# Altium schematic sheet USB.SchDoc
size A4
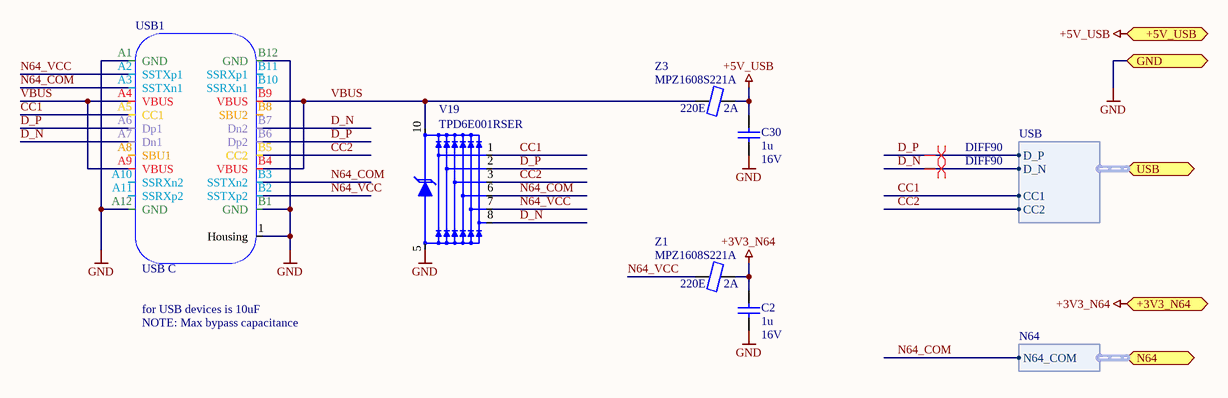
[diagram p0: USB.SchDoc]

## Parts
C2  value 1u  Value2: 16V  [SMD_CAP_0603]  (hidden comment: C_SMD_CER_1U_16V_10%_X7R_0603)
C30  value 1u  Value2: 16V  [SMD_CAP_0603]  (hidden comment: C_SMD_CER_1U_16V_10%_X7R_0603)
USB1  Type: USB C  [SMD_CON_USB_TYPEC_VERTICAL_10132328-10011LF]  (hidden comment: *)
V19  Type: TPD6E001RSER  [SMD_UQFN-10]  (hidden comment: V_SMD_TVS_TPD6E001RSER_UQFN-10)
Z1  value 220E  Type: MPZ1608S221A  Value2: 2A  [SMD_RES_0603]  (hidden comment: Z_SMD_FERRITE_2A_220E@100MHZ_0603)
Z3  value 220E  Type: MPZ1608S221A  Value2: 2A  [SMD_RES_0603]  (hidden comment: Z_SMD_FERRITE_2A_220E@100MHZ_0603)

## Ports
+3V3_N64, +5V_USB, GND, N64 (harness N64), USB (harness USB)

## Harnesses
N64: N64_COM
USB: CC1, CC2, D_N, D_P

## Nets
+3V3_N64: C2.2 Z1.2 ; port +3V3_N64
+5V_USB: C30.2 Z3.2 ; port +5V_USB
GND: C2.1 C30.1 USB1.1(Housing) USB1.A1(GND) USB1.A12(GND) USB1.B1(GND) USB1.B12(GND) V19.5 ; port GND
CC1: USB1.A5(CC1) V19.1 ; port USB.CC1
CC2: USB1.B5(CC2) V19.3 ; port USB.CC2
D_N: USB1.A7(Dn1) USB1.B7(Dn2) V19.8 ; port USB.D_N
D_P: USB1.A6(Dp1) USB1.B6(Dp2) V19.2 ; port USB.D_P
N64_COM: USB1.A3(SSTXn1) USB1.B3(SSTXn2) V19.6 ; port N64.N64_COM
N64_VCC: USB1.A2(SSTXp1) USB1.B2(SSTXp2) V19.7 Z1.1
VBUS: USB1.A4(VBUS) USB1.A9(VBUS) USB1.B4(VBUS) USB1.B9(VBUS) V19.10 Z3.1

Not connected (* = marked no-connect by the designer): USB1 A8(SBU1) A10(SSRXn2) A11(SSRXp2) B8(SBU2) B10(SSRXn1) B11(SSRXp1)

## Layout directives
differential pair; net class DIFF90: D_N, D_P

## Notes on the sheet
- for USB devices is 10uF
- NOTE: Max bypass capacitance
- Title
- Size:
- Date:
- A4
- Number:
- Time:
- Revision:
- Sheet
- of
- File:

## Library data of the parts
C2 C30 = C_SMD_CER_1U_16V_10%_X7R_0603: 1µF ±10% 16V Ceramic Capacitor X7R 0603 (1608 Metric); Supplier - Digikey: 1276-1019-1-ND
USB1 = X_CONNECTOR_USB_TYPEC_VERTICAL: USB - C (Type - C) USB 3.1 (USB 3.1 Gen 2, Superspeed+) Receptacle Connector 24 Position Surface Mount, Through Hole; Supplier - Digikey: 609-5380-1-ND
V19 = V_SMD_TVS_TPD6E001RSER_UQFN-10: Clamp Ipp Tvs Diode Surface Mount 10-UQFN (2.0x1.5); Supplier - Digikey: 296-21888-1-ND
Z1 Z3 = Z_SMD_FERRITE_2A_220E@100MHZ_0603: Ferrite Beads; Supplier - E+H Flowtec AG: 50104604; Supplier - Digikey: 445-1565-1-ND